# Altium project Rescue-MainBoard.PrjPCB
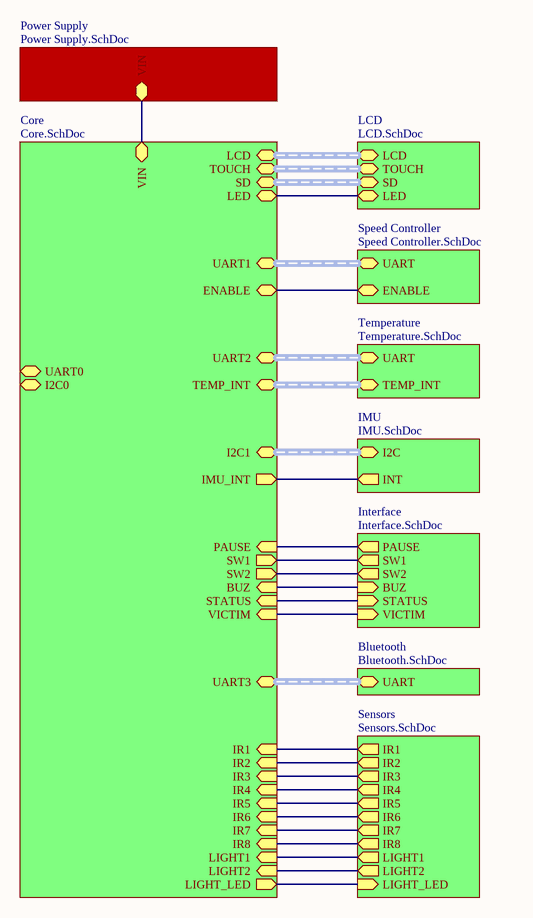
[diagram p0: General.SchDoc]
10 sheets, 142 parts. Net scope: hierarchical (ports join the sheet entries above them; power ports are global).
Board file: Rescue-MainBoard.PcbDoc
Sheets:
  General.SchDoc
    Core = Core.SchDoc
    IMU = IMU.SchDoc
    Bluetooth = Bluetooth.SchDoc
    LCD = LCD.SchDoc
    Interface = Interface.SchDoc
    Temperature = Temperature.SchDoc
    Power Supply = Power Supply.SchDoc
    Speed Controller = Speed Controller.SchDoc
    Sensors = Sensors.SchDoc

## Sheet General.SchDoc
size A4; SheetNumber: 1; SheetTotal: 3

### Sub-sheets
Bluetooth = Bluetooth.SchDoc: UART (harness UART)
Core = Core.SchDoc: LCD (harness LCD_BUS), TOUCH (harness TOUCH_BUS), PAUSE (in), UART3 (harness UART), UART1 (harness UART), UART2 (harness UART), I2C0 (harness I2C), I2C1 (harness I2C), UART0 (harness UART), IR1 (in), IR2 (in), IR3 (in), IR4 (in), IR5 (in), IR6 (in), IR7 (in), IR8 (in), LIGHT1 (in), LIGHT2 (in), VICTIM (in), SW1 (out), SW2 (out), STATUS (in), ENABLE, TEMP_INT (harness TEMP_INT), VIN, LIGHT_LED (out), BUZ (in), LED, SD (harness SD), IMU_INT (out)
IMU = IMU.SchDoc: INT (out), I2C (harness I2C)
Interface = Interface.SchDoc: PAUSE (out), VICTIM (in), SW1 (out), SW2 (out), STATUS (in), BUZ (in)
LCD = LCD.SchDoc: LCD (harness LCD_BUS), TOUCH (harness TOUCH_BUS), LED, SD (harness SD)
Power Supply = Power Supply.SchDoc: VIN
Sensors = Sensors.SchDoc: IR1 (out), IR2 (out), IR3 (out), IR4 (out), IR5 (out), IR6 (out), IR7 (out), IR8 (out), LIGHT1 (out), LIGHT2 (out), LIGHT_LED (in)
Speed Controller = Speed Controller.SchDoc: UART (harness UART), ENABLE
Temperature = Temperature.SchDoc: UART (harness UART), TEMP_INT (harness TEMP_INT)

### Nets
ENABLE: sheet Core/ENABLE, sheet Speed Controller/ENABLE
LIGHT_LED: sheet Core/LIGHT_LED, sheet Sensors/LIGHT_LED
Net*_8: sheet Core/VICTIM, sheet Interface/VICTIM
Net*_9: sheet Core/STATUS, sheet Interface/STATUS
Net*_12: sheet Core/BUZ, sheet Interface/BUZ
Net*_22: sheet Core/SW2, sheet Interface/SW2
Net*_23: sheet Core/SW1, sheet Interface/SW1
Net*_32: sheet Core/IMU_INT, sheet IMU/INT
Net*_A0: sheet Core/LIGHT1, sheet Sensors/LIGHT1
Net*_A1: sheet Core/IR1, sheet Sensors/IR1
Net*_A2: sheet Core/IR2, sheet Sensors/IR2
Net*_A3: sheet Core/IR3, sheet Sensors/IR3
Net*_A4: sheet Core/IR4, sheet Sensors/IR4
Net*_A5: sheet Core/LIGHT2, sheet Sensors/LIGHT2
Net*_A6: sheet Core/IR8, sheet Sensors/IR8
Net*_A7: sheet Core/IR7, sheet Sensors/IR7
Net*_A9: sheet Core/IR6, sheet Sensors/IR6
Net*_A10: sheet Core/IR5, sheet Sensors/IR5
Net*_A11: sheet Core/VIN, sheet Power Supply/VIN
Net*_DAC0: sheet Core/PAUSE, sheet Interface/PAUSE
Net*_DAC1: sheet Core/LED, sheet LCD/LED

### Buses and harness runs
harness sheet Bluetooth/UART = sheet Core/UART3
harness sheet Core/I2C1 = sheet IMU/I2C
harness sheet Core/LCD = sheet LCD/LCD
harness sheet Core/SD = sheet LCD/SD
harness sheet Core/TEMP_INT = sheet Temperature/TEMP_INT
harness sheet Core/TOUCH = sheet LCD/TOUCH
harness sheet Core/UART1 = sheet Speed Controller/UART
harness sheet Core/UART2 = sheet Temperature/UART

## Sheet Core.SchDoc
size A4
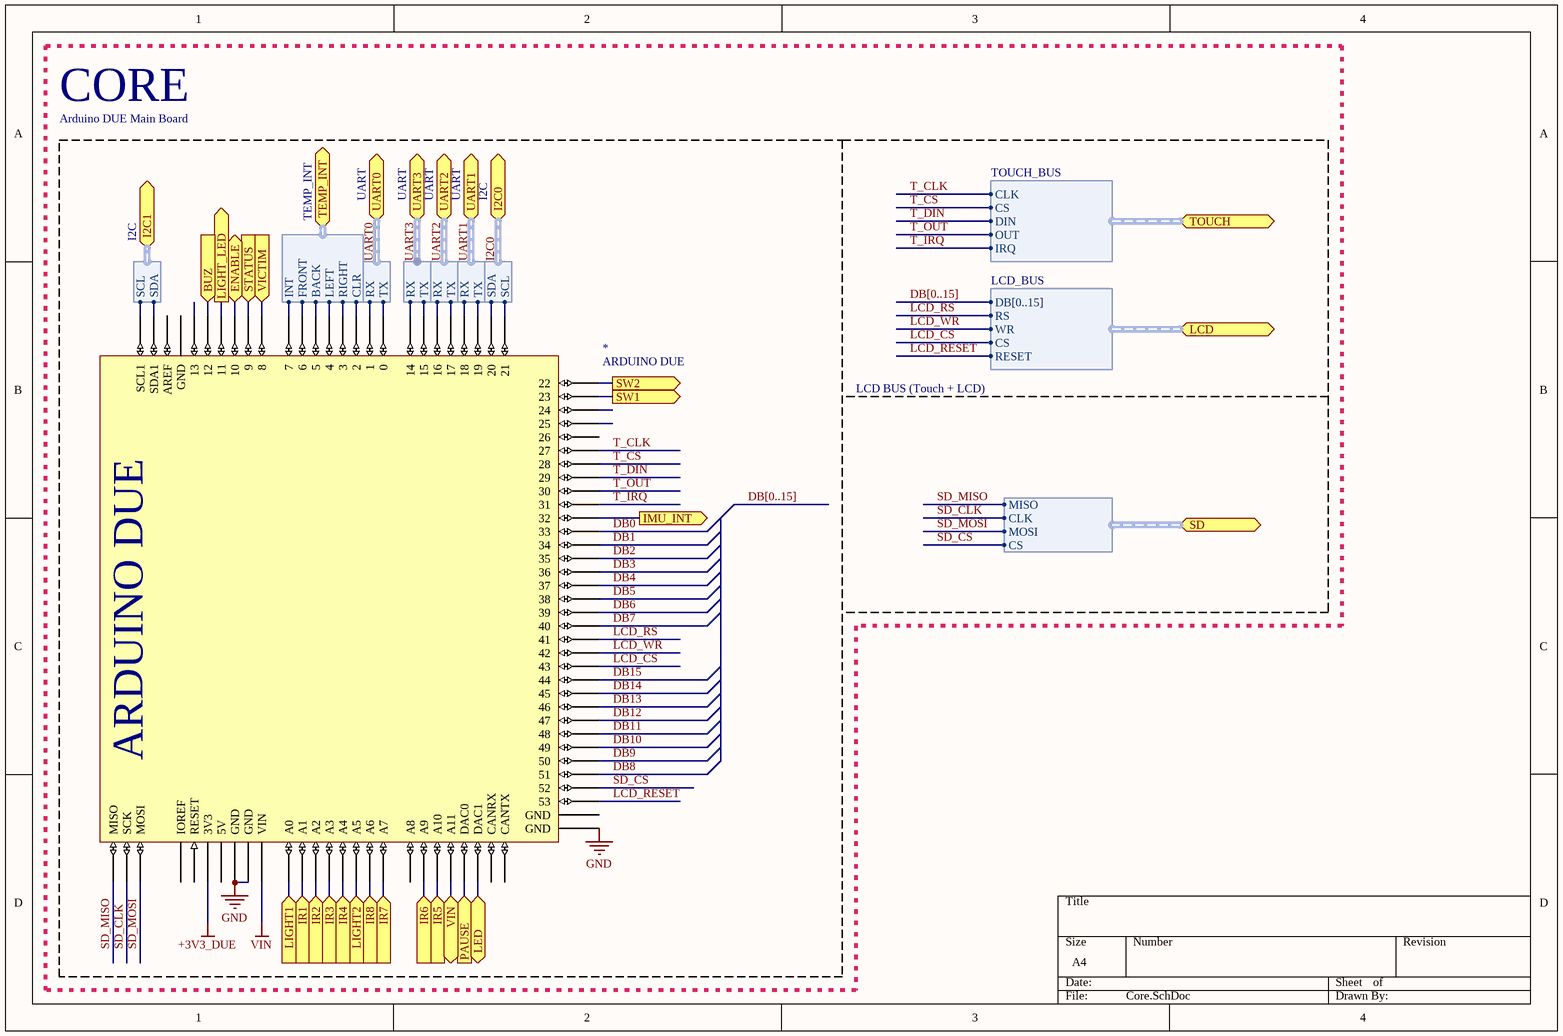
[diagram p1: Core.SchDoc]

### Parts
*  ARDUINO DUE  [ARDUINO-DUE]

### Blocks framed on the sheet
Arduino DUE Main Board: *

### Ports
BUZ (in), ENABLE, I2C0 (harness I2C), I2C1 (harness I2C), IMU_INT (out), IR1 (in), IR2 (in), IR3 (in), IR4 (in), IR5 (in), IR6 (in), IR7 (in), IR8 (in), LCD (harness LCD_BUS), LED, LIGHT1 (in), LIGHT2 (in), LIGHT_LED (out), PAUSE (in), SD (harness SD), STATUS (in), SW1 (out), SW2 (out), TEMP_INT (harness TEMP_INT), TOUCH (harness TOUCH_BUS), UART0 (harness UART), UART1 (harness UART), UART2 (harness UART), UART3 (harness UART), VICTIM (in), VIN

### Harnesses
LCD_BUS: CS, DB[0..15], RESET, RS, WR
TOUCH_BUS: CLK, CS, DIN, OUT, IRQ
UART: RX, TX
I2C: SDA, SCL
TEMP_INT: INT, FRONT, BACK, LEFT, RIGHT, CLR
SD: MISO, MOSI, CLK, CS

### Nets
+3V3_DUE: *.3V3
GND: *.GND2(GND) *.GND3(GND) *.GND5(GND)
VIN: *.VIN
DB0: *.33
DB1: *.34
DB2: *.35
DB3: *.36
DB4: *.37
DB5: *.38
DB6: *.39
DB7: *.40
DB8: *.51
DB9: *.50
DB10: *.49
DB11: *.48
DB12: *.47
DB13: *.46
DB14: *.45
DB15: *.44
ENABLE: *.10 ; port ENABLE
I2C0.SCL: *.21 ; port I2C0.SCL
I2C0.SDA: *.20 ; port I2C0.SDA
LCD_CS: *.43 ; port LCD.CS
LCD_RESET: *.53 ; port LCD.RESET
LCD_RS: *.41 ; port LCD.RS
LCD_WR: *.42 ; port LCD.WR
LIGHT_LED: *.11 ; port LIGHT_LED
SD_CLK: *.SCK ; port SD.CLK
SD_CS: *.52 ; port SD.CS
SD_MISO: *.MISO ; port SD.MISO
SD_MOSI: *.MOSI ; port SD.MOSI
T_CLK: *.27 ; port TOUCH.CLK
T_CS: *.28 ; port TOUCH.CS
T_DIN: *.29 ; port TOUCH.DIN
T_IRQ: *.31 ; port TOUCH.IRQ
T_OUT: *.30 ; port TOUCH.OUT
UART0.RX: *.1 ; port UART0.RX
UART0.TX: *.0 ; port UART0.TX
UART3.RX: *.14 ; port UART3.RX
UART3.TX: *.15 ; port UART3.TX
UART.RX: *.16 ; port UART2.RX
UART.RX: *.18 ; port UART1.RX  [a separate net that carries the same name]
UART.TX: *.17 ; port UART2.TX
UART.TX: *.19 ; port UART1.TX  [a separate net that carries the same name]
Net*_2: *.2 ; port TEMP_INT.CLR
Net*_3: *.3 ; port TEMP_INT.RIGHT
Net*_4: *.4 ; port TEMP_INT.LEFT
Net*_5: *.5 ; port TEMP_INT.BACK
Net*_6: *.6 ; port TEMP_INT.FRONT
Net*_7: *.7 ; port TEMP_INT.INT
Net*_8: *.8 ; port VICTIM
Net*_9: *.9 ; port STATUS
Net*_12: *.12 ; port BUZ
Net*_22: *.22 ; port SW2
Net*_23: *.23 ; port SW1
Net*_32: *.32 ; port IMU_INT
Net*_A0: *.A0 ; port LIGHT1
Net*_A1: *.A1 ; port IR1
Net*_A2: *.A2 ; port IR2
Net*_A3: *.A3 ; port IR3
Net*_A4: *.A4 ; port IR4
Net*_A5: *.A5 ; port LIGHT2
Net*_A6: *.A6 ; port IR8
Net*_A7: *.A7 ; port IR7
Net*_A9: *.A9 ; port IR6
Net*_A10: *.A10 ; port IR5
Net*_A11: *.A11 ; port VIN
Net*_DAC0: *.DAC0 ; port PAUSE
Net*_DAC1: *.DAC1 ; port LED
Net*_SCL1: *.SCL1 ; port I2C1.SCL
Net*_SDA1: *.SDA1 ; port I2C1.SDA

Not connected (* = marked no-connect by the designer): * 5V 13 24 25 26 A8 AREF CANRX CANTX GND1(GND) GND4(GND) IOREF RESET

### Buses and harness runs
bus DB[0..15]
harness I2C0 = port I2C0
harness UART0 = port UART0
harness UART1 = port UART1
harness UART2 = port UART2
harness UART3 = port UART3

### Notes on the sheet
- CORE
- LCD BUS (Touch + LCD)

## Sheet IMU.SchDoc: IMU Sensor
size A4; DrawnBy: Ivan Seidel; ProjectName: Soccer B Robot
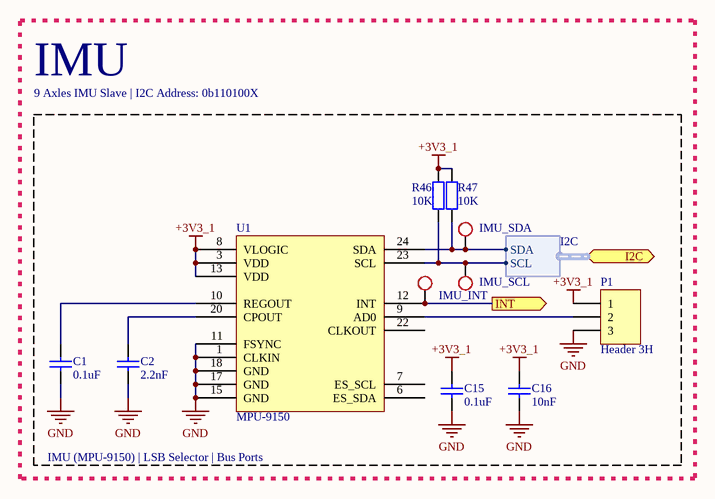
[diagram p2: IMU.SchDoc]

### Parts
C1  0.1uF  [C0805]
C2  2.2nF  [C0805]
C15  0.1uF  [C0805]
C16  10nF  [C0805]
IMU_INT  Test Point  [TP1]  (value not drawn)  (no BOM)
IMU_SCL  Test Point  [TP1]  (value not drawn)  (no BOM)
IMU_SDA  Test Point  [TP1]  (value not drawn)  (no BOM)
P1  Header 3H  [HDR1X3H]
R46  10K  [RES1206]
R47  10K  [RES1206]
U1  MPU-9150  [LGA-24]

### Ports
I2C (harness I2C), INT (out)

### Harnesses
I2C: SCL, SDA

### Nets
+3V3_1: C15.2 C16.2 P1.1 R46.1 R47.1 U1.3(VDD) U1.8(VLOGIC) U1.13(VDD)
GND: C1.1 C2.1 C15.1 C16.1 P1.3 U1.1(CLKIN) U1.11(FSYNC) U1.15(GND) U1.17(GND) U1.18(GND)
Net*_32: IMU_INT.1 U1.12(INT) ; port INT
Net*_SCL1: IMU_SCL.1 R46.2 U1.23(SCL) ; port I2C.SCL
Net*_SDA1: IMU_SDA.1 R47.2 U1.24(SDA) ; port I2C.SDA
NetC1_2: C1.2 U1.10(REGOUT)
NetC2_2: C2.2 U1.20(CPOUT)
NetP1_2: P1.2 U1.9(AD0)

Not connected (* = marked no-connect by the designer): U1 6(ES_SDA) 7(ES_SCL) 22(CLKOUT)

### Notes on the sheet
- IMU
- 9 Axles IMU Slave | I2C Address: 0b110100X
- IMU (MPU-9150) | LSB Selector | Bus Ports

### Library data of the parts
C1 C2 C15 C16 = Cap Semi: Capacitor (Semiconductor SIM Model); Published: 8-Jun-2000; LatestRevisionDate: 29-May-2009; LatestRevisionNote: IPC-7351 Footprint Added.; PackageReference: C1206; Publisher: Altium Limited; PackageDescription: Chip Capacitor
  C1 C15: Value: 0.1uF
  C2: Value: 2.2nF
  C16: Value: 10nF
IMU_INT IMU_SCL IMU_SDA = Test Point: Test Point for Osciloscope measurements
P1 = Header 3H: Header, 3-Pin, Right Angle; LatestRevisionDate: 17-Jul-2002; LatestRevisionNote: Re-released for DXP Platform.; Publisher: Altium Limited
R46 R47 = RES
U1 = MPU-9150: InveSense MPU-9150 IMU 9 axles

## Sheet Bluetooth.SchDoc
size A4
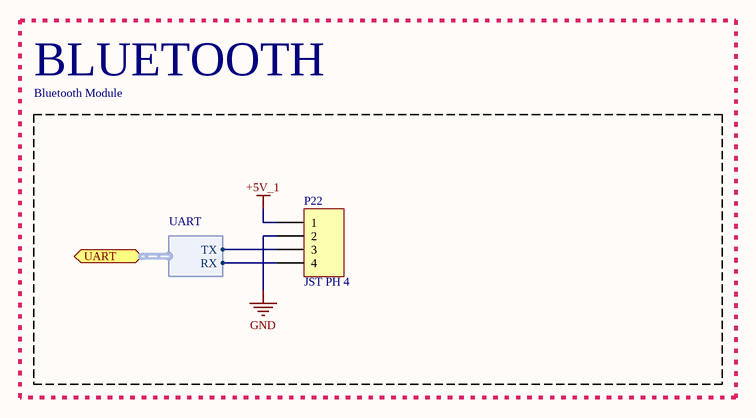
[diagram p3: Bluetooth.SchDoc]

### Parts
P22  JST PH 4  [B4B-PH-K]

### Blocks framed on the sheet
Bluetooth Module: P22

### Ports
UART (harness UART)

### Harnesses
UART: RX, TX

### Nets
+5V_1: P22.1
GND: P22.2
UART3.RX: P22.4 ; port UART.RX
UART3.TX: P22.3 ; port UART.TX

### Notes on the sheet
- BLUETOOTH

## Sheet LCD.SchDoc
size A4
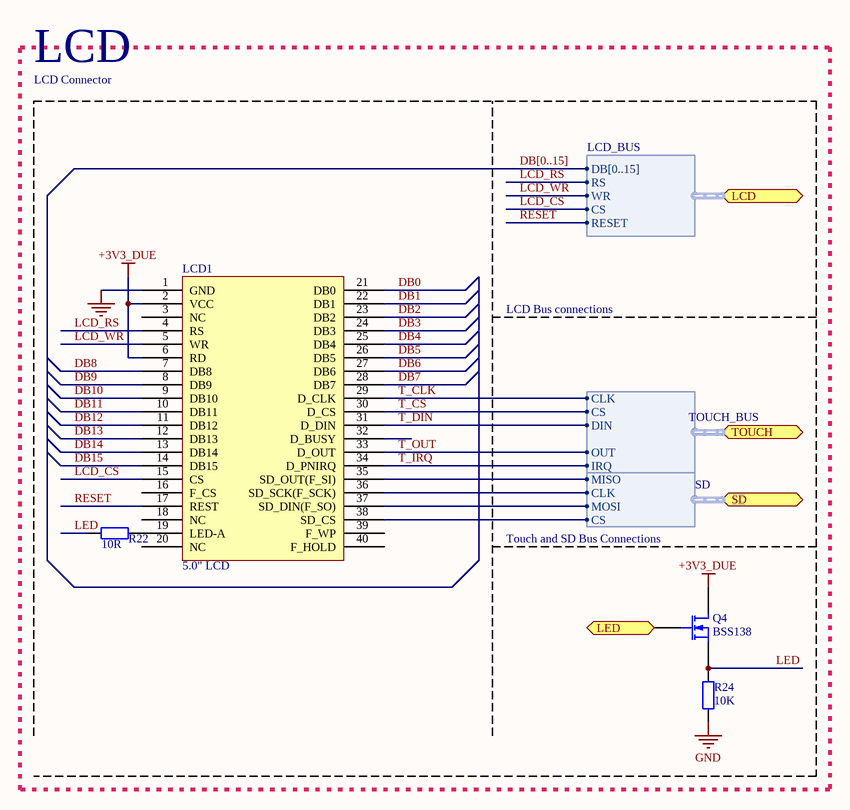
[diagram p4: LCD.SchDoc]

### Parts
LCD1  5.0" LCD  [TFT LCD 5.0 INCHES]
Q4  BSS138  [SOT23]
R22  10R  [RES1206]
R24  10K  [RES1206]

### Ports
LCD (harness LCD_BUS), LED, SD (harness SD), TOUCH (harness TOUCH_BUS)

### Harnesses
LCD_BUS: DB[0..15], RS, WR, CS, RESET
TOUCH_BUS: CLK, CS, DIN, OUT, IRQ
SD: MISO, MOSI, CLK, CS

### Nets
+3V3_DUE: LCD1.2(VCC) LCD1.6(RD) Q4.1(D)
GND: LCD1.1(GND) R24.2
DB0: LCD1.21(DB0)
DB1: LCD1.22(DB1)
DB2: LCD1.23(DB2)
DB3: LCD1.24(DB3)
DB4: LCD1.25(DB4)
DB5: LCD1.26(DB5)
DB6: LCD1.27(DB6)
DB7: LCD1.28(DB7)
DB8: LCD1.7(DB8)
DB9: LCD1.8(DB9)
DB10: LCD1.9(DB10)
DB11: LCD1.10(DB11)
DB12: LCD1.11(DB12)
DB13: LCD1.12(DB13)
DB14: LCD1.13(DB14)
DB15: LCD1.14(DB15)
LCD_CS: LCD1.15(CS) ; port LCD.CS
LCD_RS: LCD1.4(RS) ; port LCD.RS
LCD_WR: LCD1.5(WR) ; port LCD.WR
LED: Q4.2(S) R22.2 R24.1
RESET: LCD1.17(REST) ; port LCD.RESET  [project net LCD_RESET]
SD_CLK: LCD1.36(SD_SCK(F_SCK)) ; port SD.CLK
SD_CS: LCD1.38(SD_CS) ; port SD.CS
SD_MISO: LCD1.35(SD_OUT(F_SI)) ; port SD.MISO
SD_MOSI: LCD1.37(SD_DIN(F_SO)) ; port SD.MOSI
T_CLK: LCD1.29(D_CLK) ; port TOUCH.CLK
T_CS: LCD1.30(D_CS) ; port TOUCH.CS
T_DIN: LCD1.31(D_DIN) ; port TOUCH.DIN
T_IRQ: LCD1.34(D_PNIRQ) ; port TOUCH.IRQ
T_OUT: LCD1.33(D_OUT) ; port TOUCH.OUT
Net*_DAC1: Q4.3(G) ; port LED
NetLCD1_19: LCD1.19(LED-A) R22.1

Not connected (* = marked no-connect by the designer): LCD1 3(NC) 16(F_CS) 18(NC) 20(NC) 32(D_BUSY) 39(F_WP) 40(F_HOLD)

### Buses and harness runs
bus DB[0..15]

### Notes on the sheet
- LCD
- LCD Connector
- LCD Bus connections
- Touch and SD Bus Connections

### Library data of the parts
LCD1 = TFT LCD 5.0 INCHES
Q4 = BSS138: N-Channel Enhancement Mode Vertical DMOS FET; Published: 17-Dec-2003; DatasheetVersion: Mar-96; PackageVersion: 1996; PackageReference: SOT23; Publisher: Altium Limited; PackageDescription: SOT-23; 3 Leads; Body 3.1 x 2.5 mm, inc. leads (LxW max), Alternate Lead Configuration; ComponentLink1Description: Manufacturer Link; ComponentLink1URL: http://www.zetex.com/; ComponentLink2Description: Datasheet; ComponentLink2URL: www.zetex.com/3.0/pdf/BSS138.pdf
R22 R24 = RES

## Sheet Interface.SchDoc
size A4
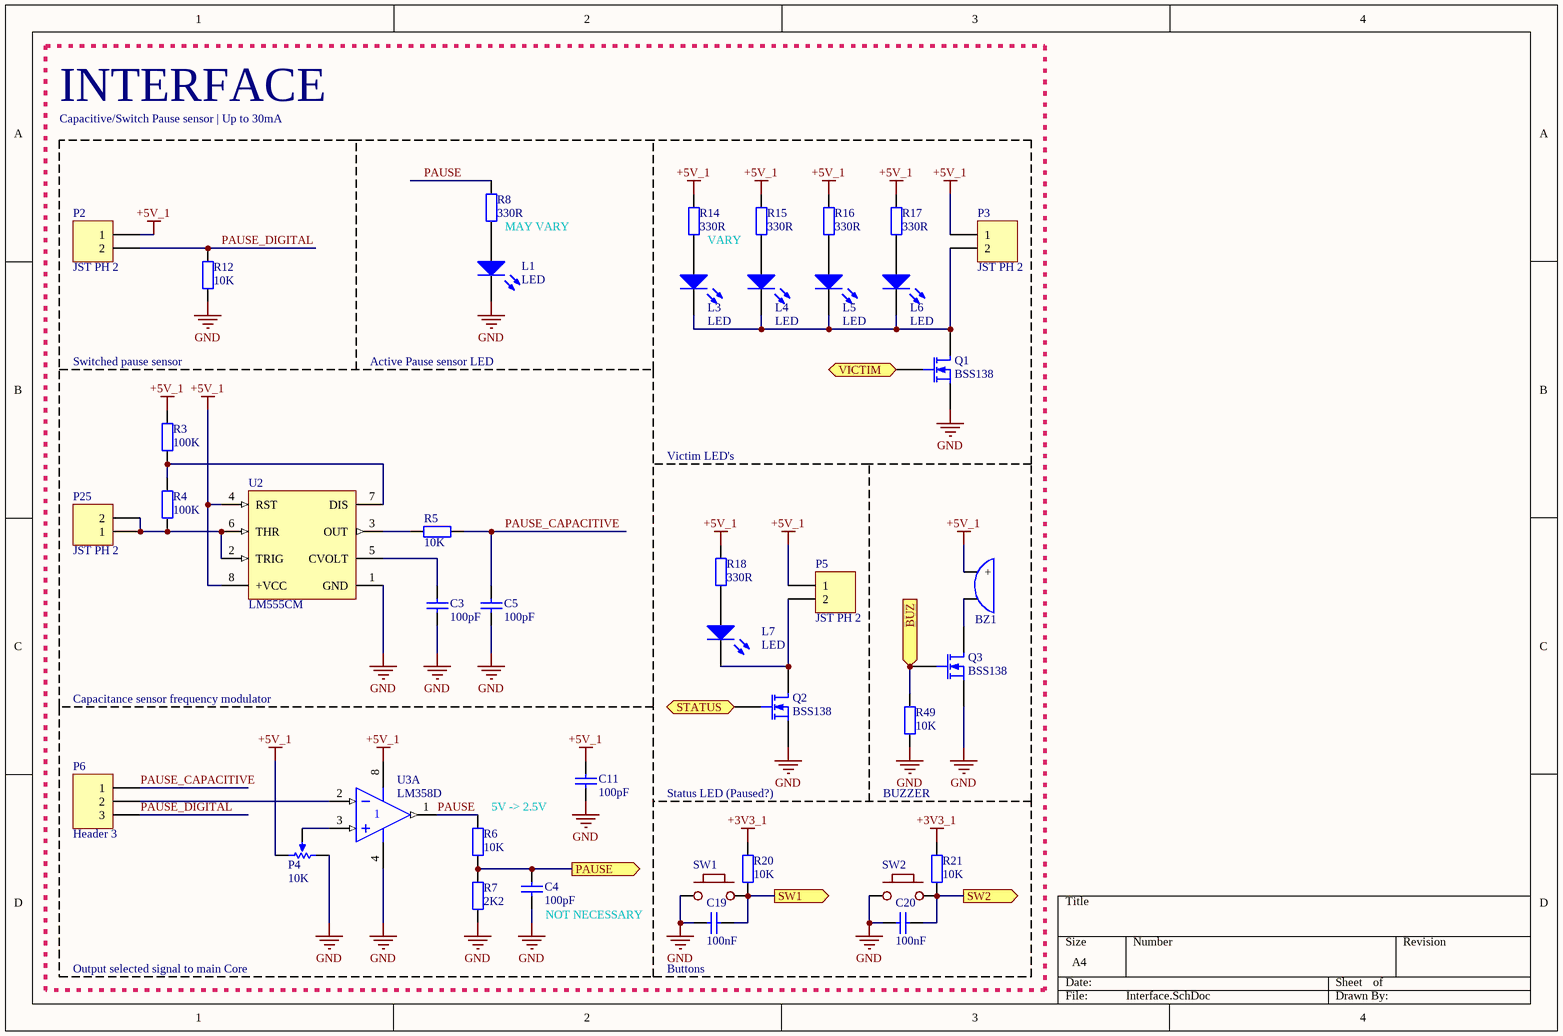
[diagram p5: Interface.SchDoc]

### Parts
BZ1  Buzzer  [BUZZER]  (value not drawn)
C3  100pF  [C0805]
C4  100pF  [C0805]
C5  100pF  [C0805]
C11  100pF  [C0805]
C19  100nF  [6-0805_N]
C20  100nF  [6-0805_N]
L1  LED  [LED0805]
L3  LED  [LED0805]
L4  LED  [LED0805]
L5  LED  [LED0805]
L6  LED  [LED0805]
L7  LED  [LED0805]
P2  JST PH 2  [B2B-PH-K]
P3  JST PH 2  [B2B-PH-K]
P4  10K  [TRIMPOT-3296W]
P5  JST PH 2  [B2B-PH-K]
P6  Header 3  [HDR1X3]
P25  JST PH 2  [B2B-PH-K]
Q1  BSS138  [SOT23]
Q2  BSS138  [SOT23]
Q3  BSS138  [SOT23]
R3  100K  [RES1206]
R4  100K  [RES1206]
R5  10K  [RES1206]
R6  10K  [RES1206]
R7  2K2  [RES1206]
R8  330R  [RES1206]
R12  10K  [RES1206]
R14  330R  [RES1206]
R15  330R  [RES1206]
R16  330R  [RES1206]
R17  330R  [RES1206]
R18  330R  [RES1206]
R20  10K  [RES1206]
R21  10K  [RES1206]
R49  10K  [RES1206]
SW1  PUSH BUTTON  [PUSH-BUTTON 5,2X1,6MM]  (value not drawn)
SW2  PUSH BUTTON  [PUSH-BUTTON 5,2X1,6MM]  (value not drawn)
U2  LM555CM  [M08A_N]
U3  LM358D  [751-02_N]  (part A of 2)

### Ports
BUZ (in), PAUSE (out), STATUS (in), SW1 (out), SW2 (out), VICTIM (in)

### Nets
+3V3_1: R20.1 R21.1
+5V_1: BZ1.1(+) C11.2 P2.1 P3.1 P4.3(BOT) P5.1 R3.2 R14.1 R15.1 R16.1 R17.1 R18.1 U2.4(RST) U2.8(+VCC) U3.8(V+)
GND: C3.1 C4.1 C5.1 C11.1 C19.2 C20.2 L1.2(K) P4.1(TOP) Q1.2(S) Q2.2(S) Q3.2(S) R7.1 R12.1 R49.2 SW1.1 SW2.1 U2.1(GND) U3.4(V-)
PAUSE: R6.2 R8.1 U3.1(OUT)
PAUSE_CAPACITIVE: C5.2 P6.1 R5.1
PAUSE_DIGITAL: P2.2 P6.3 R12.2
Net*_8: Q1.3(G) ; port VICTIM
Net*_9: Q2.3(G) ; port STATUS
Net*_12: Q3.3(G) R49.1 ; port BUZ
Net*_22: C20.1 R21.2 SW2.2 ; port SW2
Net*_23: C19.1 R20.2 SW1.2 ; port SW1
Net*_DAC0: C4.2 R6.1 R7.2 ; port PAUSE
NetBZ1_2: BZ1.2 Q3.1(D)
NetC3_2: C3.2 U2.5(CVOLT)
NetL1_1: L1.1(A) R8.2
NetL3_1: L3.1(A) R14.2
NetL3_2: L3.2(K) L4.2(K) L5.2(K) L6.2(K) P3.2 Q1.1(D)
NetL4_1: L4.1(A) R15.2
NetL5_1: L5.1(A) R16.2
NetL6_1: L6.1(A) R17.2
NetL7_1: L7.1(A) R18.2
NetL7_2: L7.2(K) P5.2 Q2.1(D)
NetP4_2: P4.2(TAP) U3.3(IN+)
NetP6_2: P6.2 U3.2(IN-)
NetP25_1: P25.1 P25.2 R4.1 U2.2(TRIG) U2.6(THR)
NetR3_1: R3.1 R4.2 U2.7(DIS)
NetR5_2: R5.2 U2.3(OUT)

### Notes on the sheet
- INTERFACE
- Capacitive/Switch Pause sensor | Up to 30mA
- (near R8) MAY VARY
- (near R14) VARY
- Switched pause sensor
- Active Pause sensor LED
- Victim LED's
- Capacitance sensor frequency modulator
- (near R6) 5V -> 2.5V
- Status LED (Paused?)
- BUZZER
- (near C4) NOT NECESSARY
- Output selected signal to main Core
- (near C19) Buttons

### Library data of the parts
C3-C5 C11 C19 C20 = Cap Semi: Capacitor (Semiconductor SIM Model); Published: 8-Jun-2000; LatestRevisionDate: 29-May-2009; LatestRevisionNote: IPC-7351 Footprint Added.; PackageReference: C1206; Publisher: Altium Limited; PackageDescription: Chip Capacitor
  C19 C20: Value: 100nF
P4 = TRIMPOT
P6 = Header 3: Header, 3-Pin; LatestRevisionDate: 17-Jul-2002; LatestRevisionNote: Re-released for DXP Platform.; Publisher: Altium Limited
Q1-Q3 = BSS138: as Q4 on sheet LCD; Published: 17-Dec-2003; DatasheetVersion: Mar-96; PackageVersion: 1996; PackageReference: SOT23; Publisher: Altium Limited; PackageDescription: SOT-23; 3 Leads; Body 3.1 x 2.5 mm, inc. leads (LxW max), Alternate Lead Configuration; ComponentLink1Description: Manufacturer Link; ComponentLink1URL: http://www.zetex.com/; ComponentLink2Description: Datasheet; ComponentLink2URL: www.zetex.com/3.0/pdf/BSS138.pdf
R3-R8 R12 R14-R18 R20 R21 R49 = RES
U2 = LM555CM: Timer, 8-pin Narrow SOIC; Manufacturer: National Semiconductor; PackageTopMarking: NSZXTT*LM*555CM; PowerWise: N; CompType: Analog IC; Published: 4-Dec-2008; DatasheetVersion: Jul-2006; PackageVersion: revM, May-2009; PackageReference: M08A; Publisher: Altium Limited; PackageDescription: SOIC Narrow, 4.9 x 3.9 x 1.45mm, 8 Lead, 1.27mm Pitch; Supplier 1: Farnell; Supplier Part Number 1: 9488227; PartNumber: LM555CM; RoHS: N; PinCount: 8; Code_JEDEC: MS-012-AA; Code_IPC: SOIC127P600-8; ComponentLink1Description: LM555 Datasheet; ComponentLink1URL: http://www.national.com/ds/LM/LM555.pdf; ComponentLink2Description: LM555 Web Page; ComponentLink2URL: http://www.national.com/pf/LM/LM555.html; ComponentLink3Description: M08A Package Page; ComponentLink3URL: http://www.national.com/packaging/folders/m08a.html
U3 = LM358D: Dual Low-Power Operational Amplifier; Published: 17-Jul-2002; LatestRevisionDate: 13-Apr-2006; LatestRevisionNote: IPC-7351 Footprint Added.; DatasheetVersion: 1988; PackageReference: 751-02; Publisher: Altium Limited; PackageDescription: 8-Pin Small Outline Integrated Circuit 1.27 mm Pitch; Code_JEDEC: MS-012-AA; Code_IPC: SOIC127P600-8; ComponentLink1Description: Manufacturer Link; ComponentLink1URL: http://www.onsemi.com/site/products/parametrics/0,4446,251,00.html; ComponentLink2Description: Datasheet; ComponentLink2URL: http://www.onsemi.com/pub/Collateral/LM358-D.PDF

## Sheet Temperature.SchDoc
size A4; PageSetup: Record=PageOptions|CenterHorizontal=True|CenterVertical=True|PrintScale=1.00|XCorrection=1.00|YCorrection=1.00|PrintKind=1|BorderSize=5000000|LeftOffset=0|BottomOffset=0|Orientation=2|PaperLength=1000|PaperWidth=1000|Scale=100|PaperSource=7|PrintQuality=-4|MediaType=1|DitherType=10|PaperKind=A4 (210 x 297 mm)|PrintScaleMode=1
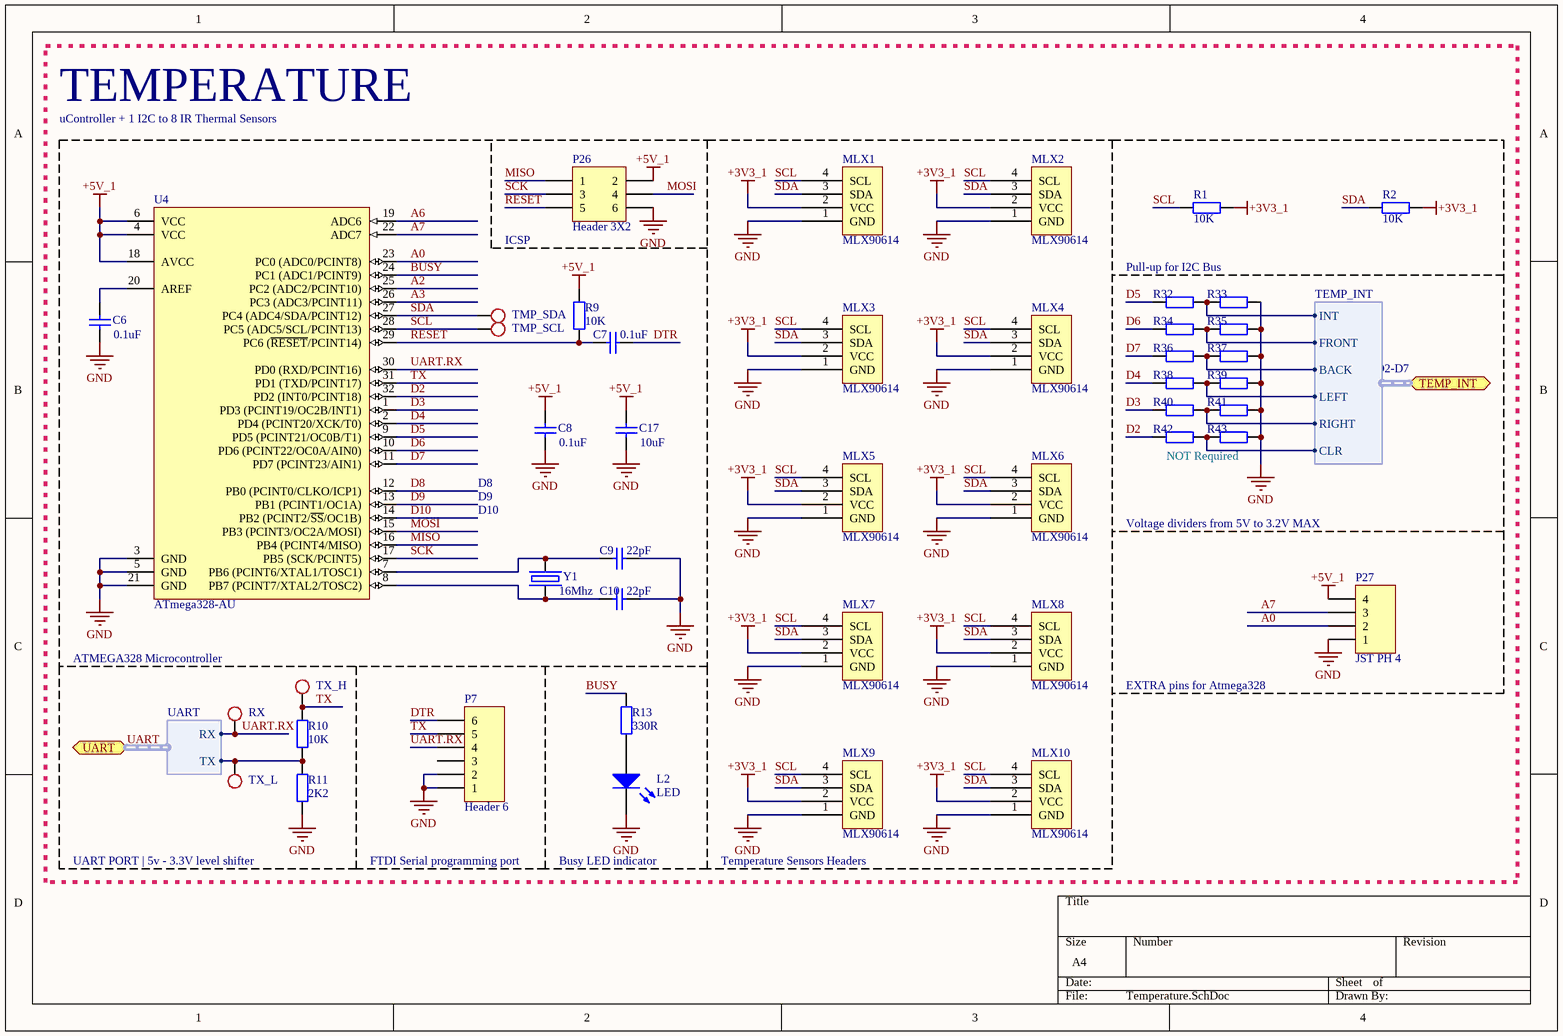
[diagram p6: Temperature.SchDoc]

### Parts
C6  0.1uF  [C0805]
C7  0.1uF  [C0805]
C8  0.1uF  [C0805]
C9  22pF  [C0805]
C10  22pF  [C0805]
C17  10uF  [C1206]
L2  LED  [LED0805]
MLX1  MLX90614  [MLX-BREAKOUT]
MLX2  MLX90614  [MLX-BREAKOUT]
MLX3  MLX90614  [MLX-BREAKOUT]
MLX4  MLX90614  [MLX-BREAKOUT]
MLX5  MLX90614  [MLX-BREAKOUT]
MLX6  MLX90614  [MLX-BREAKOUT]
MLX7  MLX90614  [MLX-BREAKOUT]
MLX8  MLX90614  [MLX-BREAKOUT]
MLX9  MLX90614  [MLX-BREAKOUT]
MLX10  MLX90614  [MLX-BREAKOUT]
P7  Header 6  [HDR1X6]
P26  Header 3X2  [HDR2X3]
P27  JST PH 4  [B4B-PH-K]
R1  10K  [RES1206]
R2  10K  [RES1206]
R9  10K  [RES1206]
R10  10K  [RES1206]
R11  2K2  [RES1206]
R13  330R  [RES1206]
R32  10K  [RES1206]  (value not drawn)
R33  2K2  [RES1206]  (value not drawn)
R34  10K  [RES1206]  (value not drawn)
R35  2K2  [RES1206]  (value not drawn)
R36  10K  [RES1206]  (value not drawn)
R37  2K2  [RES1206]  (value not drawn)
R38  10K  [RES1206]  (value not drawn)
R39  2K2  [RES1206]  (value not drawn)
R40  10K  [RES1206]  (value not drawn)
R41  2K2  [RES1206]  (value not drawn)
R42  10K  [RES1206]  (value not drawn)
R43  2K2  [RES1206]  (value not drawn)
RX  Test Point  [TP1]  (value not drawn)  (no BOM)
TMP_SCL  Test Point  [TP1]  (value not drawn)  (no BOM)
TMP_SDA  Test Point  [TP1]  (value not drawn)  (no BOM)
TX_H  Test Point  [TP1]  (value not drawn)  (no BOM)
TX_L  Test Point  [TP1]  (value not drawn)  (no BOM)
U4  ATmega328-AU  [32A_N]
Y1  16Mhz  [OSC-2-PIN-TH]

### Ports
TEMP_INT (harness TEMP_INT), UART (harness UART)

### Harnesses
UART: RX, TX
TEMP_INT: INT, FRONT, BACK, LEFT, RIGHT, CLR

### Nets
+3V3_1: MLX1.2(VCC) MLX2.2(VCC) MLX3.2(VCC) MLX4.2(VCC) MLX5.2(VCC) MLX6.2(VCC) MLX7.2(VCC) MLX8.2(VCC) MLX9.2(VCC) MLX10.2(VCC) R1.2 R2.2
+5V_1: C8.2 C17.2 P26.2 P27.4 R9.1 U4.4(VCC) U4.6(VCC) U4.18(AVCC)
GND: C6.1 C8.1 C9.2 C10.2 C17.1 L2.2(K) MLX1.1(GND) MLX2.1(GND) MLX3.1(GND) MLX4.1(GND) MLX5.1(GND) MLX6.1(GND) MLX7.1(GND) MLX8.1(GND) MLX9.1(GND) MLX10.1(GND) P7.1 P7.2 P26.6 P27.1 R11.1 R33.2 R35.2 R37.2 R39.2 R41.2 R43.2 U4.3(GND) U4.5(GND) U4.21(GND)
A0: P27.2 U4.23(PC0_(ADC0/PCINT8))
A2: U4.25(PC2_(ADC2/PCINT10))
A3: U4.26(PC3_(ADC3/PCINT11))
A6: U4.19(ADC6)
A7: P27.3 U4.22(ADC7)
BUSY: R13.2 U4.24(PC1_(ADC1/PCINT9))
D2: R42.1 U4.32(PD2_(INT0/PCINT18))
D3: R40.1 U4.1(PD3_(PCINT19/OC2B/INT1))
D4: R38.1 U4.2(PD4_(PCINT20/XCK/T0))
D5: R32.1 U4.9(PD5_(PCINT21/OC0B/T1))
D6: R34.1 U4.10(PD6_(PCINT22/OC0A/AIN0))
D7: R36.1 U4.11(PD7_(PCINT23/AIN1))
D8: U4.12(PB0_(PCINT0/CLKO/ICP1))
D9: U4.13(PB1_(PCINT1/OC1A))
D10: U4.14(PB2_(PCINT2/~{SS}/OC1B))
DTR: C7.2 P7.6
MISO: P26.1 U4.16(PB4_(PCINT4/MISO))
MOSI: P26.4 U4.15(PB3_(PCINT3/OC2A/MOSI))
RESET: C7.1 P26.5 R9.2 U4.29(PC6_(~{RESET}/PCINT14))
SCK: P26.3 U4.17(PB5_(SCK/PCINT5))
SCL: MLX1.4(SCL) MLX2.4(SCL) MLX3.4(SCL) MLX4.4(SCL) MLX5.4(SCL) MLX6.4(SCL) MLX7.4(SCL) MLX8.4(SCL) MLX9.4(SCL) MLX10.4(SCL) R1.1 TMP_SCL.1 U4.28(PC5_(ADC5/SCL/PCINT13))
SDA: MLX1.3(SDA) MLX2.3(SDA) MLX3.3(SDA) MLX4.3(SDA) MLX5.3(SDA) MLX6.3(SDA) MLX7.3(SDA) MLX8.3(SDA) MLX9.3(SDA) MLX10.3(SDA) R2.1 TMP_SDA.1 U4.27(PC4_(ADC4/SDA/PCINT12))
TX: P7.5 R10.2 TX_H.1 U4.31(PD1_(TXD/PCINT17))
UART.RX: P7.4 RX.1 U4.30(PD0_(RXD/PCINT16)) ; port UART.RX
UART.TX: R10.1 R11.2 TX_L.1 ; port UART.TX
Net*_2: R42.2 R43.1 ; port TEMP_INT.CLR
Net*_3: R40.2 R41.1 ; port TEMP_INT.RIGHT
Net*_4: R38.2 R39.1 ; port TEMP_INT.LEFT
Net*_5: R36.2 R37.1 ; port TEMP_INT.BACK
Net*_6: R34.2 R35.1 ; port TEMP_INT.FRONT
Net*_7: R32.2 R33.1 ; port TEMP_INT.INT
NetC6_2: C6.2 U4.20(AREF)
NetC9_1: C9.1 U4.7(PB6_(PCINT6/XTAL1/TOSC1)) Y1.1
NetC10_1: C10.1 U4.8(PB7_(PCINT7/XTAL2/TOSC2)) Y1.2
NetL2_1: L2.1(A) R13.1

Not connected (* = marked no-connect by the designer): P7 3

### Buses and harness runs
harness UART = port UART

### Notes on the sheet
- TEMPERATURE
- uController + 1 I2C to 8 IR Thermal Sensors
- ICSP
- Pull-up for I2C Bus
- D2-D7
- D8
- D9
- D10
- NOT Required
- Voltage dividers from 5V to 3.2V MAX
- ATMEGA328 Microcontroller
- EXTRA pins for Atmega328
- UART PORT | 5v - 3.3V level shifter
- FTDI Serial programming port
- Busy LED indicator
- (near MLX9) Temperature Sensors Headers

### Library data of the parts
C6-C10 C17 = Cap Semi: Capacitor (Semiconductor SIM Model); Published: 8-Jun-2000; LatestRevisionDate: 29-May-2009; LatestRevisionNote: IPC-7351 Footprint Added.; PackageReference: C1206; Publisher: Altium Limited; PackageDescription: Chip Capacitor
MLX1-MLX10 = MLX-BREAKOUT
P7 = Header 6: Header, 6-Pin; LatestRevisionDate: 17-Jul-2002; LatestRevisionNote: Re-released for DXP Platform.; Publisher: Altium Limited
P26 = Header 3X2: Header, 3-Pin, Dual row; LatestRevisionDate: 17-Jul-2002; LatestRevisionNote: Re-released for DXP Platform.; Publisher: Altium Limited
R1 R2 R9-R11 R13 R32-R43 = RES
RX TMP_SCL TMP_SDA TX_H TX_L = Test Point: Test Point for Osciloscope measurements
U4 = ATmega328-AU: 8-bit AVR Microcontroller, 32KB Flash, 1KB EEPROM, 2KB SRAM, 32-pin TQFP, Industrial Grade (-40°C to 85°C); Published: 1-Apr-2010; DatasheetVersion: revA, Jan-2010; PackageVersion: revB, Oct-2001; PackageReference: 32A; Publisher: Altium Limited; PackageDescription: 32-Lead, 7x7x1.0 mm Body, 0.8mm Lead Pitch, Thin Profile Plastic Quad Flat Package (TQFP); Supplier 1: Digi-Key; Supplier Part Number 1: ATMEGA328-AU-ND; Supplier 2: Mouser; Supplier Part Number 2: 556-ATMEGA328-AU; Code_JEDEC: MS-026-ABA; ComponentLink1Description: Manufacturer Link; ComponentLink1URL: http://www.atmel.com/products/avr/default.asp?; ComponentLink2Description: ATmega48A/48PA/88A/88PA/168A/168PA/328/328P Datasheet; ComponentLink2URL: http://www.atmel.com/dyn/resources/prod_documents/8271.pdf; ComponentLink3Description: ATmega48A/48PA/88A/88PA/168A/168PA/328/328P Summary; ComponentLink3URL: http://www.atmel.com/dyn/resources/prod_documents/8271S.pdf; ComponentLink4Description: Atmel.com Home; ComponentLink4URL: http://www.atmel.com
Y1 = OSC-2-PIN: 2 pin oscilator

## Sheet Power Supply.SchDoc
size A4
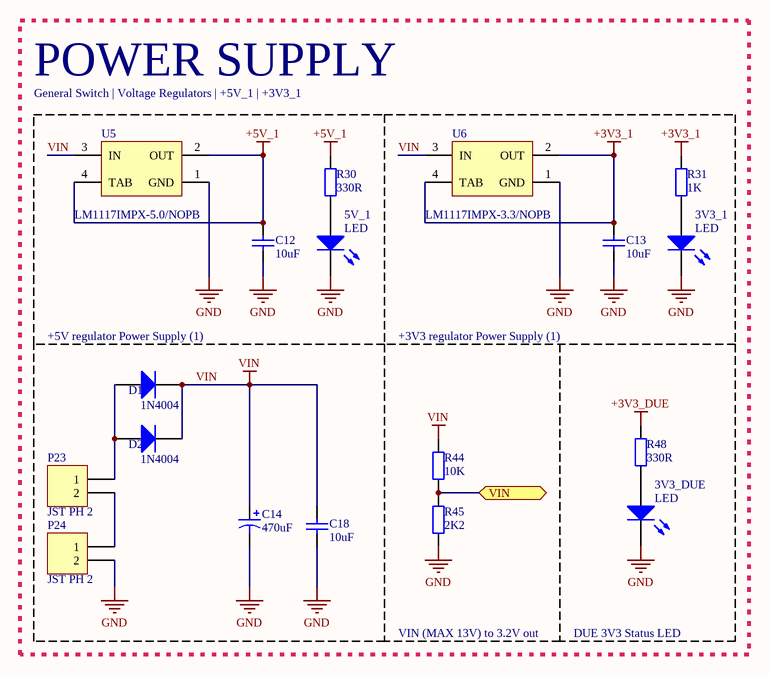
[diagram p7: Power Supply.SchDoc]

### Parts
3V3_1  LED  [LED0805]
3V3_DUE  LED  [LED0805]
5V_1  LED  [LED0805]
C12  10uF  [C1206]
C13  10uF  [C1206]
C14  470uF  [CAPPR3.5-8X11.5]
C18  10uF  [C1206]
D1  1N4004  [DIODESMA]
D2  1N4004  [DIODESMA]
P23  JST PH 2  [B2B-PH-K]
P24  JST PH 2  [B2B-PH-K]
R30  330R  [RES1206]
R31  1K  [RES1206]
R44  10K  [RES1206]
R45  2K2  [RES1206]
R48  330R  [RES1206]
U5  LM1117IMPX-5.0/NOPB  [MP04A_N]
U6  LM1117IMPX-3.3/NOPB  [MP04A_N]

### Ports
VIN

### Nets
+3V3_1: C13.2 R31.2 U6.2(OUT) U6.4(TAB)
+3V3_DUE: R48.2
+5V_1: C12.2 R30.2 U5.2(OUT) U5.4(TAB)
GND: 3V3_1.2(K) 3V3_DUE.2(K) 5V_1.2(K) C12.1 C13.1 C14.2 C18.1 P24.2 R45.1 U5.1(GND) U6.1(GND)
VIN: C14.1 C18.2 D1.1(K) D2.1(K) R44.2 U5.3(IN) U6.3(IN)
Net3V3_1_1: 3V3_1.1(A) R31.1
Net3V3_DUE_1: 3V3_DUE.1(A) R48.1
Net5V_1_1: 5V_1.1(A) R30.1
Net*_A11: R44.1 R45.2 ; port VIN
NetD1_2: D1.2(A) D2.2(A) P23.1
NetP23_2: P23.2 P24.1

### Notes on the sheet
- POWER SUPPLY
- General Switch | Voltage Regulators | +5V_1 | +3V3_1
- (near D1) +5V regulator Power Supply (1)
- +3V3 regulator Power Supply (1)
- VIN (MAX 13V) to 3.2V out
- DUE 3V3 Status LED

### Library data of the parts
C12 C13 C18 = Cap Semi: Capacitor (Semiconductor SIM Model); Published: 8-Jun-2000; LatestRevisionDate: 29-May-2009; LatestRevisionNote: IPC-7351 Footprint Added.; PackageReference: C1206; Publisher: Altium Limited; PackageDescription: Chip Capacitor; Value: 10uF
C14 = EKA00PB310J00: Aluminum Electrolytic Capacitor, Radial Style with Long Leads: 100uF, 63V; Note: Refer to Manufacturer's Data Sheets for other lead formations; DrillSize: Nominal, Rounded To The Nearest 0.1mm; Published: 19-Mar-2004; DatasheetDocument: 20-Feb-2001; PackageReference: CAPPR3.5-8X11.5; Publisher: Altium Limited; ComponentLink1Description: Manufacturer Link; ComponentLink1URL: http://www.vishay.com/; ComponentLink2Description: Datasheet; ComponentLink2URL: http://www.vishay.com/docs/25014/eka.pdf; Value: 100uF
D1 D2 = DIODE
R30 R31 R44 R45 R48 = RES
U5 = LM1117IMPX-5.0/NOPB: 800mA Low-Dropout Linear Regulator, 4-pin SOT-223, Pb-Free; Manufacturer: National Semiconductor; PackageTopMarking: XYTT*N06B; PowerWise: N; CompType: LDO IC; Published: 1-Mar-2010; DatasheetVersion: Apr-2006; PackageVersion: revB, Apr-2003; PackageReference: MP04A; Publisher: Altium Limited; PackageDescription: Molded SOT-223, 6.50 x 3.56 x 1.6mm Body, 4 Lead, 2.3mm Pitch; Supplier 1: Digi-Key; Supplier Part Number 1: LM1117IMPX-5.0-ND; PartNumber: LM1117IMPX-5.0/NOPB; RoHS: Y; PinCount: 4; Code_JEDEC: TO-261-AA; Code_IPC: SOT223-4; ComponentLink1Description: LM1117 Datasheet; ComponentLink1URL: http://www.national.com/ds/LM/LM1117.pdf; ComponentLink2Description: LM1117 Web Page; ComponentLink2URL: http://www.national.com/pf/LM/LM1117.html; ComponentLink3Description: MP04A Package Page; ComponentLink3URL: http://www.national.com/packaging/folders/mp04a.html
U6 = LM1117IMPX-3.3/NOPB: 800mA Low-Dropout Linear Regulator, 4-pin SOT-223, Pb-Free; Manufacturer: National Semiconductor; PackageTopMarking: XYTT*N05B; PowerWise: N; CompType: LDO IC; Published: 1-Mar-2010; DatasheetVersion: Apr-2006; PackageVersion: revB, Apr-2003; PackageReference: MP04A; Publisher: Altium Limited; PackageDescription: Molded SOT-223, 6.50 x 3.56 x 1.6mm Body, 4 Lead, 2.3mm Pitch; Supplier 1: Digi-Key; Supplier Part Number 1: LM1117IMPX-3.3-ND; PartNumber: LM1117IMPX-3.3/NOPB; RoHS: Y; PinCount: 4; Code_JEDEC: TO-261-AA; Code_IPC: SOT223-4; ComponentLink1Description: LM1117 Datasheet; ComponentLink1URL: http://www.national.com/ds/LM/LM1117.pdf; ComponentLink2Description: LM1117 Web Page; ComponentLink2URL: http://www.national.com/pf/LM/LM1117.html; ComponentLink3Description: MP04A Package Page; ComponentLink3URL: http://www.national.com/packaging/folders/mp04a.html

## Sheet Speed Controller.SchDoc
size A4
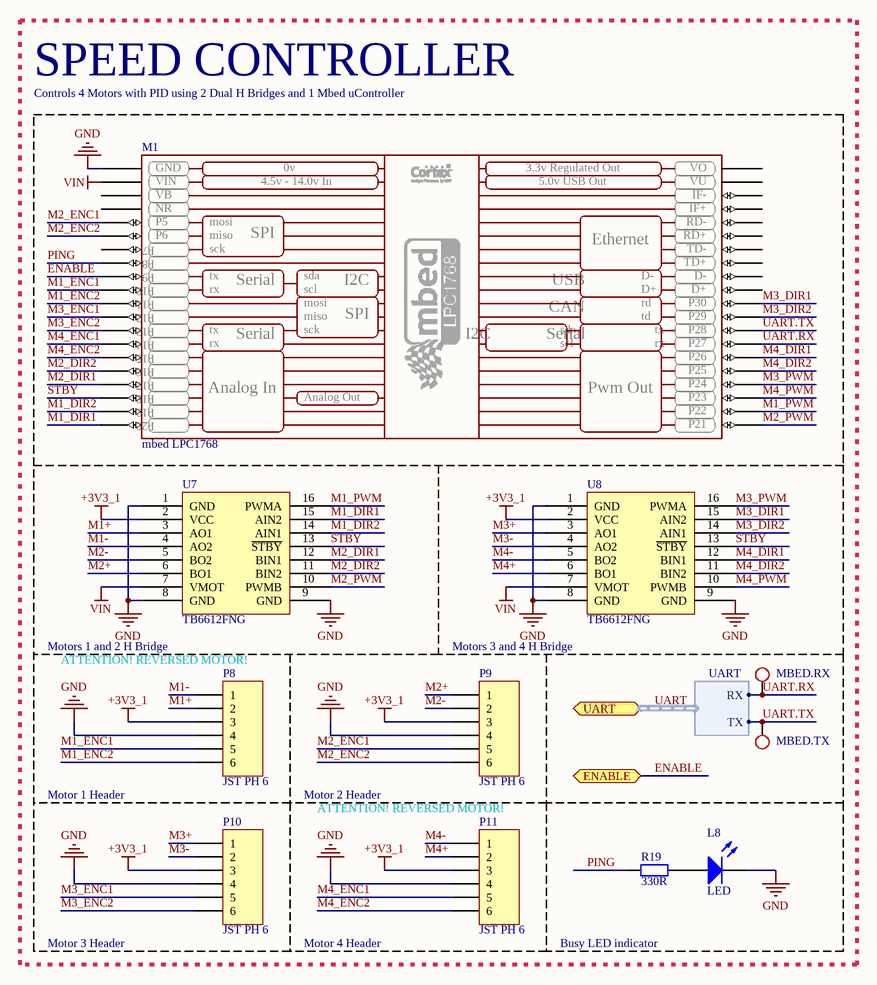
[diagram p8: Speed Controller.SchDoc]

### Parts
L8  LED  [LED0805]
M1  mbed LPC1768  [DIP40-LARGE]
MBED.RX  Test Point  [TP1]  (value not drawn)  (no BOM)
MBED.TX  Test Point  [TP1]  (value not drawn)  (no BOM)
P8  JST PH 6  [B6B-PH-K]
P9  JST PH 6  [B6B-PH-K]
P10  JST PH 6  [B6B-PH-K]
P11  JST PH 6  [B6B-PH-K]
R19  330R  [RES1206]
U7  TB6612FNG  [TB6612FNG]
U8  TB6612FNG  [TB6612FNG]

### Ports
ENABLE, UART (harness UART)

### Harnesses
UART: RX, TX

### Nets
+3V3_1: P8.3 P9.3 P10.3 P11.3 U7.2(VCC) U8.2(VCC)
GND: L8.2(K) M1.1(GND) P8.4 P9.4 P10.4 P11.4 U7.1(GND) U7.8(GND) U7.9(GND) U8.1(GND) U8.8(GND) U8.9(GND)
VIN: M1.2(VIN) U7.7(VMOT) U8.7(VMOT)
ENABLE: M1.9(P9) ; port ENABLE
M1+: P8.2 U7.3(AO1)
M1-: P8.1 U7.4(AO2)
M1_DIR1: M1.20(P20) U7.15(AIN2)
M1_DIR2: M1.19(P19) U7.14(AIN1)
M1_ENC1: M1.10(P10) P8.5
M1_ENC2: M1.11(P11) P8.6
M1_PWM: M1.22(P22) U7.16(PWMA)
M2+: P9.1 U7.6(BO1)
M2-: P9.2 U7.5(BO2)
M2_DIR1: M1.17(P17) U7.12(BIN1)
M2_DIR2: M1.16(P16) U7.11(BIN2)
M2_ENC1: M1.5(P5) P9.5
M2_ENC2: M1.6(P6) P9.6
M2_PWM: M1.21(P21) U7.10(PWMB)
M3+: P10.1 U8.3(AO1)
M3-: P10.2 U8.4(AO2)
M3_DIR1: M1.30(P30) U8.15(AIN2)
M3_DIR2: M1.29(P29) U8.14(AIN1)
M3_ENC1: M1.12(P12) P10.5
M3_ENC2: M1.13(P13) P10.6
M3_PWM: M1.24(P24) U8.16(PWMA)
M4+: P11.2 U8.6(BO1)
M4-: P11.1 U8.5(BO2)
M4_DIR1: M1.26(P26) U8.12(BIN1)
M4_DIR2: M1.25(P25) U8.11(BIN2)
M4_ENC1: M1.14(P14) P11.5
M4_ENC2: M1.15(P15) P11.6
M4_PWM: M1.23(P23) U8.10(PWMB)
PING: M1.8(P8) R19.2
STBY: M1.18(P18) U7.13(~{STBY}) U8.13(~{STBY})
UART.RX: M1.27(P27) MBED.RX.1 ; port UART.RX
UART.TX: M1.28(P28) MBED.TX.1 ; port UART.TX
NetL8_1: L8.1(A) R19.1

Not connected (* = marked no-connect by the designer): M1 3(VB) 4(NR) 7(P7) 31(D+) 32(D-) 33(TD+) 34(TD-) 35(RD+) 36(RD-) 37(IF+) 38(IF-) 39(VU) 40(VO)

### Buses and harness runs
harness UART = port UART

### Notes on the sheet
- SPEED CONTROLLER
- Controls 4 Motors with PID using 2 Dual H Bridges and 1 Mbed uController
- Motors 1 and 2 H Bridge
- (near P8) ATTENTION! REVERSED MOTOR!
- Motors 3 and 4 H Bridge
- Motor 1 Header
- Motor 2 Header
- ATTENTION! REVERSED MOTOR!
- Motor 3 Header
- Motor 4 Header
- Busy LED indicator
- (in symbol mbed LPC1768) 0v; 3.3v Regulated Out; 4.5v - 14.0v In; 5.0v USB Out; mosi; miso; SPI; Ethernet; sck; tx; sda; Serial; I2C; USB; rx; scl; rd; CAN; td; Analog In; Pwm Out; Analog Out

### Library data of the parts
MBED.RX MBED.TX = Test Point: Test Point for Osciloscope measurements
R19 = RES
U7 U8 = TB6612FNG: H BRIDGE

## Sheet Sensors.SchDoc
size A4
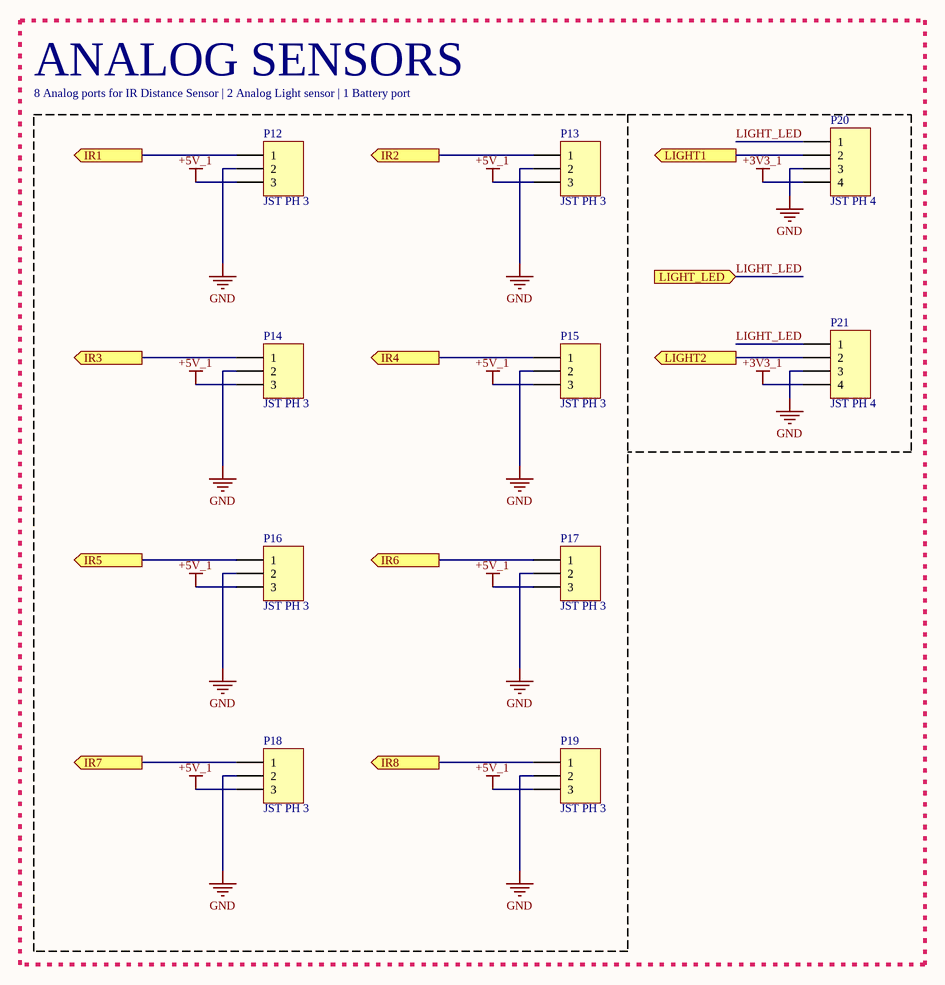
[diagram p9: Sensors.SchDoc]

### Parts
P12  JST PH 3  [B3B-PH-K]
P13  JST PH 3  [B3B-PH-K]
P14  JST PH 3  [B3B-PH-K]
P15  JST PH 3  [B3B-PH-K]
P16  JST PH 3  [B3B-PH-K]
P17  JST PH 3  [B3B-PH-K]
P18  JST PH 3  [B3B-PH-K]
P19  JST PH 3  [B3B-PH-K]
P20  JST PH 4  [B4B-PH-K]
P21  JST PH 4  [B4B-PH-K]

### Blocks framed on the sheet
ANALOG SENSORS: P12-P21

### Ports
IR1 (out), IR2 (out), IR3 (out), IR4 (out), IR5 (out), IR6 (out), IR7 (out), IR8 (out), LIGHT1 (out), LIGHT2 (out), LIGHT_LED (in)

### Nets
+3V3_1: P20.4 P21.4
+5V_1: P12.3 P13.3 P14.3 P15.3 P16.3 P17.3 P18.3 P19.3
GND: P12.2 P13.2 P14.2 P15.2 P16.2 P17.2 P18.2 P19.2 P20.3 P21.3
LIGHT_LED: P20.1 P21.1 ; port LIGHT_LED
Net*_A0: P20.2 ; port LIGHT1
Net*_A1: P12.1 ; port IR1
Net*_A2: P13.1 ; port IR2
Net*_A3: P14.1 ; port IR3
Net*_A4: P15.1 ; port IR4
Net*_A5: P21.2 ; port LIGHT2
Net*_A6: P19.1 ; port IR8
Net*_A7: P18.1 ; port IR7
Net*_A9: P17.1 ; port IR6
Net*_A10: P16.1 ; port IR5

### Notes on the sheet
- 8 Analog ports for IR Distance Sensor | 2 Analog Light sensor | 1 Battery port

## Nets that join several sheets
+3V3_1: IMU (8 pins), Interface (R20.1 R21.1), Temperature (12 pins), Power Supply (C13.2 R31.2 U6.2 U6.4), Speed Controller (6 pins), Sensors (P20.4 P21.4)
+3V3_DUE: Core (*.3V3), LCD (LCD1.2 LCD1.6 Q4.1), Power Supply (R48.2)
+5V_1: Bluetooth (P22.1), Interface (15 pins), Temperature (8 pins), Power Supply (C12.2 R30.2 U5.2 U5.4), Sensors (8 pins)
GND: Core (*.GND2 *.GND3 *.GND5), IMU (10 pins), Bluetooth (P22.2), LCD (LCD1.1 R24.2), Interface (18 pins), Temperature (30 pins), Power Supply (11 pins), Speed Controller (12 pins), Sensors (10 pins)
VIN: Core (*.VIN), Power Supply (7 pins), Speed Controller (M1.2 U7.7 U8.7)
DB0: Core (*.33), LCD (LCD1.21)
DB1: Core (*.34), LCD (LCD1.22)
DB2: Core (*.35), LCD (LCD1.23)
DB3: Core (*.36), LCD (LCD1.24)
DB4: Core (*.37), LCD (LCD1.25)
DB5: Core (*.38), LCD (LCD1.26)
DB6: Core (*.39), LCD (LCD1.27)
DB7: Core (*.40), LCD (LCD1.28)
DB8: Core (*.51), LCD (LCD1.7)
DB9: Core (*.50), LCD (LCD1.8)
DB10: Core (*.49), LCD (LCD1.9)
DB11: Core (*.48), LCD (LCD1.10)
DB12: Core (*.47), LCD (LCD1.11)
DB13: Core (*.46), LCD (LCD1.12)
DB14: Core (*.45), LCD (LCD1.13)
DB15: Core (*.44), LCD (LCD1.14)
ENABLE: Core (*.10), Speed Controller (M1.9)
LCD_CS: Core (*.43), LCD (LCD1.15)
LCD_RESET: Core (*.53), LCD (LCD1.17)
LCD_RS: Core (*.41), LCD (LCD1.4)
LCD_WR: Core (*.42), LCD (LCD1.5)
LIGHT_LED: Core (*.11), Sensors (P20.1 P21.1)
Net*_2: Core (*.2), Temperature (R42.2 R43.1)
Net*_3: Core (*.3), Temperature (R40.2 R41.1)
Net*_4: Core (*.4), Temperature (R38.2 R39.1)
Net*_5: Core (*.5), Temperature (R36.2 R37.1)
Net*_6: Core (*.6), Temperature (R34.2 R35.1)
Net*_7: Core (*.7), Temperature (R32.2 R33.1)
Net*_8: Core (*.8), Interface (Q1.3)
Net*_9: Core (*.9), Interface (Q2.3)
Net*_12: Core (*.12), Interface (Q3.3 R49.1)
Net*_22: Core (*.22), Interface (C20.1 R21.2 SW2.2)
Net*_23: Core (*.23), Interface (C19.1 R20.2 SW1.2)
Net*_32: Core (*.32), IMU (IMU_INT.1 U1.12)
Net*_A0: Core (*.A0), Sensors (P20.2)
Net*_A1: Core (*.A1), Sensors (P12.1)
Net*_A2: Core (*.A2), Sensors (P13.1)
Net*_A3: Core (*.A3), Sensors (P14.1)
Net*_A4: Core (*.A4), Sensors (P15.1)
Net*_A5: Core (*.A5), Sensors (P21.2)
Net*_A6: Core (*.A6), Sensors (P19.1)
Net*_A7: Core (*.A7), Sensors (P18.1)
Net*_A9: Core (*.A9), Sensors (P17.1)
Net*_A10: Core (*.A10), Sensors (P16.1)
Net*_A11: Core (*.A11), Power Supply (R44.1 R45.2)
Net*_DAC0: Core (*.DAC0), Interface (C4.2 R6.1 R7.2)
Net*_DAC1: Core (*.DAC1), LCD (Q4.3)
Net*_SCL1: Core (*.SCL1), IMU (IMU_SCL.1 R46.2 U1.23)
Net*_SDA1: Core (*.SDA1), IMU (IMU_SDA.1 R47.2 U1.24)
SD_CLK: Core (*.SCK), LCD (LCD1.36)
SD_CS: Core (*.52), LCD (LCD1.38)
SD_MISO: Core (*.MISO), LCD (LCD1.35)
SD_MOSI: Core (*.MOSI), LCD (LCD1.37)
T_CLK: Core (*.27), LCD (LCD1.29)
T_CS: Core (*.28), LCD (LCD1.30)
T_DIN: Core (*.29), LCD (LCD1.31)
T_IRQ: Core (*.31), LCD (LCD1.34)
T_OUT: Core (*.30), LCD (LCD1.33)
UART3.RX: Core (*.14), Bluetooth (P22.4)
UART3.TX: Core (*.15), Bluetooth (P22.3)
UART.RX: Core (*.16), Temperature (P7.4 RX.1 U4.30)
UART.RX: Core (*.18), Speed Controller (M1.27 MBED.RX.1)
UART.TX: Core (*.17), Temperature (R10.1 R11.2 TX_L.1)
UART.TX: Core (*.19), Speed Controller (M1.28 MBED.TX.1)